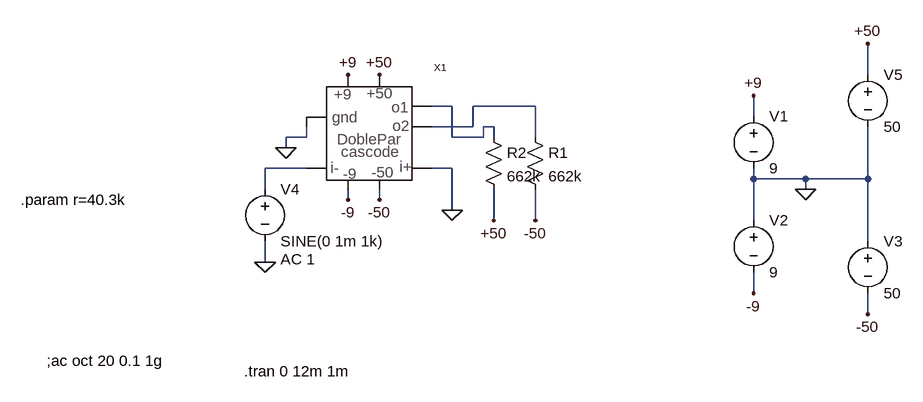
[diagram p0: schematic doble-par-cascode.asc]
doble-par-cascode.asc, the LTspice schematic file:
Version 4
SHEET 1 940 680
WIRE 880 32 880 -16
WIRE 240 80 208 80
WIRE 368 80 272 80
WIRE 704 96 704 64
WIRE 272 112 272 80
WIRE 272 112 208 112
WIRE 304 112 288 112
WIRE 16 128 16 112
WIRE 16 128 -16 128
WIRE 240 128 240 80
WIRE 288 128 288 112
WIRE 288 128 240 128
WIRE 304 128 304 112
WIRE 368 128 368 80
WIRE -16 144 -16 128
WIRE 16 176 -48 176
WIRE 240 176 208 176
WIRE 704 192 704 176
WIRE 784 192 704 192
WIRE 880 192 880 112
WIRE 880 192 784 192
WIRE -48 208 -48 176
WIRE 784 208 784 192
WIRE 80 224 80 208
WIRE 128 224 128 208
WIRE 240 240 240 176
WIRE 304 256 304 208
WIRE 368 256 368 208
WIRE 704 256 704 192
WIRE 880 288 880 192
WIRE -48 320 -48 288
WIRE 704 368 704 336
WIRE 880 400 880 368
FLAG 784 208 0
FLAG 704 64 +9
FLAG 704 368 -9
FLAG 880 400 -50
FLAG 80 32 +9
FLAG 80 224 -9
FLAG 128 224 -50
FLAG 240 240 0
FLAG -48 320 0
FLAG 880 -16 +50
FLAG 128 32 +50
FLAG -16 144 0
FLAG 368 256 -50
FLAG 304 256 +50
SYMBOL rui\\shortcuts\\voltage 704 80 R0
WINDOW 123 0 0 Left 2
WINDOW 39 0 0 Left 2
SYMATTR InstName V1
SYMATTR Value 9
SYMBOL rui\\shortcuts\\voltage 704 240 R0
WINDOW 123 0 0 Left 2
WINDOW 39 0 0 Left 2
SYMATTR InstName V2
SYMATTR Value 9
SYMBOL rui\\shortcuts\\voltage 880 272 R0
WINDOW 123 0 0 Left 2
WINDOW 39 0 0 Left 2
SYMATTR InstName V3
SYMATTR Value 50
SYMBOL rui\\shortcuts\\voltage -48 192 R0
WINDOW 123 24 124 Left 2
WINDOW 39 0 0 Left 2
SYMATTR Value2 AC 1
SYMATTR InstName V4
SYMATTR Value SINE(0 1m 1k)
SYMBOL res 352 112 R0
SYMATTR InstName R1
SYMATTR Value 662k
SYMBOL ss-doble-par-cascode 112 112 R0
SYMATTR InstName X1
SYMBOL rui\\shortcuts\\voltage 880 16 R0
WINDOW 123 0 0 Left 2
WINDOW 39 0 0 Left 2
SYMATTR InstName V5
SYMATTR Value 50
SYMBOL res 288 112 R0
SYMATTR InstName R2
SYMATTR Value 662k
TEXT -80 488 Left 2 !.tran 0 12m 1m
TEXT -384 472 Left 2 !;ac oct 20 0.1 1g
TEXT -424 224 Left 2 !.param r=40.3k

The netlist it stands for:
* doble-par-cascode.asc
V1 +9 0 9
V2 0 -9 9
V3 0 -50 50
V4 N003 0 SINE(0 1m 1k) AC 1
R1 N002 -50 662k
XX1 N003 0 N001 +50 -50 0 N002 +9 -9 ss-doble-par-cascode rcs=40k  ; pins i- i+ o1 +50 -50 grnd o2 +9 -9
V5 +50 0 50
R2 N001 +50 662k
.tran 0 12m 1m
;ac oct 20 0.1 1g
.param r=40.3k
.backanno
.end